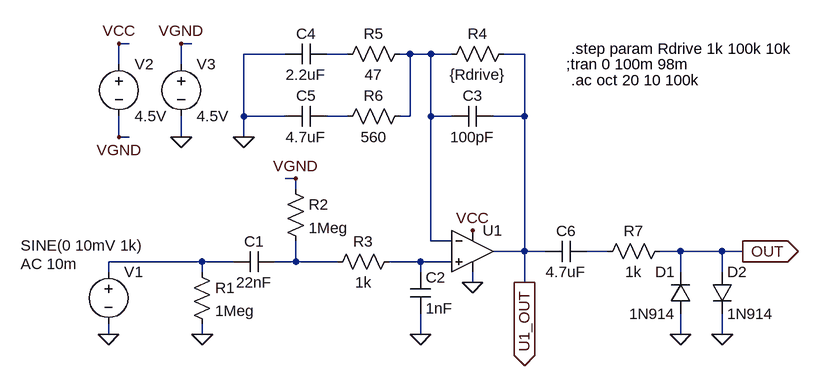
[diagram p0: schematic proco-rat_2.asc]
proco-rat_2.asc, the LTspice schematic file:
Version 4
SHEET 1 1464 680
WIRE 192 -240 176 -240
WIRE 288 -240 272 -240
WIRE 432 -224 368 -224
WIRE 528 -224 496 -224
WIRE 624 -224 608 -224
WIRE 656 -224 624 -224
WIRE 688 -224 656 -224
WIRE 800 -224 768 -224
WIRE 176 -208 176 -240
WIRE 272 -208 272 -240
WIRE 368 -128 368 -224
WIRE 432 -128 368 -128
WIRE 528 -128 496 -128
WIRE 624 -128 624 -224
WIRE 624 -128 608 -128
WIRE 656 -128 656 -224
WIRE 688 -128 656 -128
WIRE 800 -128 800 -224
WIRE 800 -128 752 -128
WIRE 176 -96 176 -128
WIRE 192 -96 176 -96
WIRE 272 -96 272 -128
WIRE 368 -96 368 -128
WIRE 448 -32 432 -32
WIRE 448 -16 448 -32
WIRE 656 64 656 -128
WIRE 688 64 656 64
WIRE 800 80 800 -128
WIRE 800 80 752 80
WIRE 832 80 800 80
WIRE 928 80 896 80
WIRE 1040 80 1008 80
WIRE 1104 80 1040 80
WIRE 1136 80 1104 80
WIRE 304 96 160 96
WIRE 352 96 304 96
WIRE 448 96 448 64
WIRE 448 96 416 96
WIRE 512 96 448 96
WIRE 640 96 592 96
WIRE 688 96 640 96
WIRE 160 112 160 96
WIRE 304 112 304 96
WIRE 640 112 640 96
WIRE 1040 112 1040 80
WIRE 1104 112 1104 80
WIRE 720 128 720 112
WIRE 800 128 800 80
WIRE 160 208 160 192
WIRE 304 208 304 192
WIRE 640 208 640 176
WIRE 1040 208 1040 176
WIRE 1104 208 1104 176
FLAG 176 -96 VGND
FLAG 272 -240 VGND
FLAG 272 -96 0
FLAG 176 -240 VCC
FLAG 160 208 0
FLAG 304 208 0
FLAG 640 208 0
FLAG 720 128 0
FLAG 720 48 VCC
FLAG 1040 208 0
FLAG 1104 208 0
FLAG 1136 80 OUT
IOPIN 1136 80 Out
FLAG 448 -32 VGND
FLAG 368 -96 0
FLAG 800 128 U1_OUT
IOPIN 800 128 Out
SYMBOL voltage 160 96 R0
WINDOW 3 -135 -25 Left 2
WINDOW 123 -135 3 Left 2
WINDOW 39 0 0 Left 2
SYMATTR Value SINE(0 10mV 1k)
SYMATTR Value2 AC 10m
SYMATTR InstName V1
SYMBOL res 288 96 R0
SYMATTR InstName R1
SYMATTR Value 1Meg
SYMBOL cap 416 80 R90
WINDOW 0 0 32 VBottom 2
WINDOW 3 32 32 VTop 2
SYMATTR InstName C1
SYMATTR Value 22nF
SYMBOL res 432 -32 R0
SYMATTR InstName R2
SYMATTR Value 1Meg
SYMBOL res 608 80 R90
WINDOW 0 0 56 VBottom 2
WINDOW 3 32 56 VTop 2
SYMATTR InstName R3
SYMATTR Value 1k
SYMBOL cap 624 112 R0
SYMATTR InstName C2
SYMATTR Value 1nF
SYMBOL Opamps\\UniversalOpamp2 720 80 R0
SYMATTR InstName U1
SYMBOL cap 752 -144 R90
WINDOW 0 0 32 VBottom 2
WINDOW 3 32 32 VTop 2
SYMATTR InstName C3
SYMATTR Value 100pF
SYMBOL res 784 -240 R90
WINDOW 0 0 56 VBottom 2
WINDOW 3 32 56 VTop 2
SYMATTR InstName R4
SYMATTR Value {Rdrive}
SYMBOL res 624 -240 R90
WINDOW 0 0 56 VBottom 2
WINDOW 3 32 56 VTop 2
SYMATTR InstName R5
SYMATTR Value 47
SYMBOL res 624 -144 R90
WINDOW 0 0 56 VBottom 2
WINDOW 3 32 56 VTop 2
SYMATTR InstName R6
SYMATTR Value 560
SYMBOL cap 496 -240 R90
WINDOW 0 0 32 VBottom 2
WINDOW 3 32 32 VTop 2
SYMATTR InstName C4
SYMATTR Value 2.2uF
SYMBOL cap 496 -144 R90
WINDOW 0 0 32 VBottom 2
WINDOW 3 32 32 VTop 2
SYMATTR InstName C5
SYMATTR Value 4.7uF
SYMBOL cap 896 64 R90
WINDOW 0 0 32 VBottom 2
WINDOW 3 32 32 VTop 2
SYMATTR InstName C6
SYMATTR Value 4.7uF
SYMBOL res 1024 64 R90
WINDOW 0 0 56 VBottom 2
WINDOW 3 32 56 VTop 2
SYMATTR InstName R7
SYMATTR Value 1k
SYMBOL voltage 176 -224 R0
SYMATTR InstName V2
SYMATTR Value 4.5V
SYMBOL voltage 272 -224 R0
WINDOW 123 0 0 Left 2
WINDOW 39 0 0 Left 2
SYMATTR InstName V3
SYMATTR Value 4.5V
SYMBOL diode 1056 176 R180
WINDOW 0 24 64 Left 2
WINDOW 3 24 0 Left 2
SYMATTR InstName D1
SYMATTR Value 1N914
SYMBOL diode 1088 112 R0
SYMATTR InstName D2
SYMATTR Value 1N914
TEXT 872 -232 Left 2 !.step param Rdrive 1k 100k 10k
TEXT 864 -208 Left 2 !;tran 0 100m 98m
TEXT 872 -184 Left 2 !.ac oct 20 10 100k

The netlist it stands for:
* proco-rat_2.asc
V1 N005 0 SINE(0 10mV 1k) AC 10m
R1 N005 0 1Meg
C1 N006 N005 22nF
R2 VGND N006 1Meg
R3 N007 N006 1k
C2 N007 0 1nF
XU1 N007 N002 VCC 0 U1_OUT level.2 Avol=1Meg GBW=10Meg Slew=10Meg ilimit=25m rail=0 Vos=0 phimargin=45 en=0 enk=0 in=0 ink=0 Rin=500Meg  ; pins IN+ IN- V+ V- OUT
C3 U1_OUT N002 100pF
R4 U1_OUT N002 {Rdrive}
R5 N002 N001 47
R6 N002 N003 560
C4 N001 0 2.2uF
C5 N003 0 4.7uF
C6 N004 U1_OUT 4.7uF
R7 OUT N004 1k
V2 VCC VGND 4.5V
V3 VGND 0 4.5V
D1 0 OUT 1N914
D2 OUT 0 1N914
.model D D
.lib standard.dio
.step param Rdrive 1k 100k 10k
;tran 0 100m 98m
.ac oct 20 10 100k
.lib UniversalOpamps2.sub
.backanno
.end